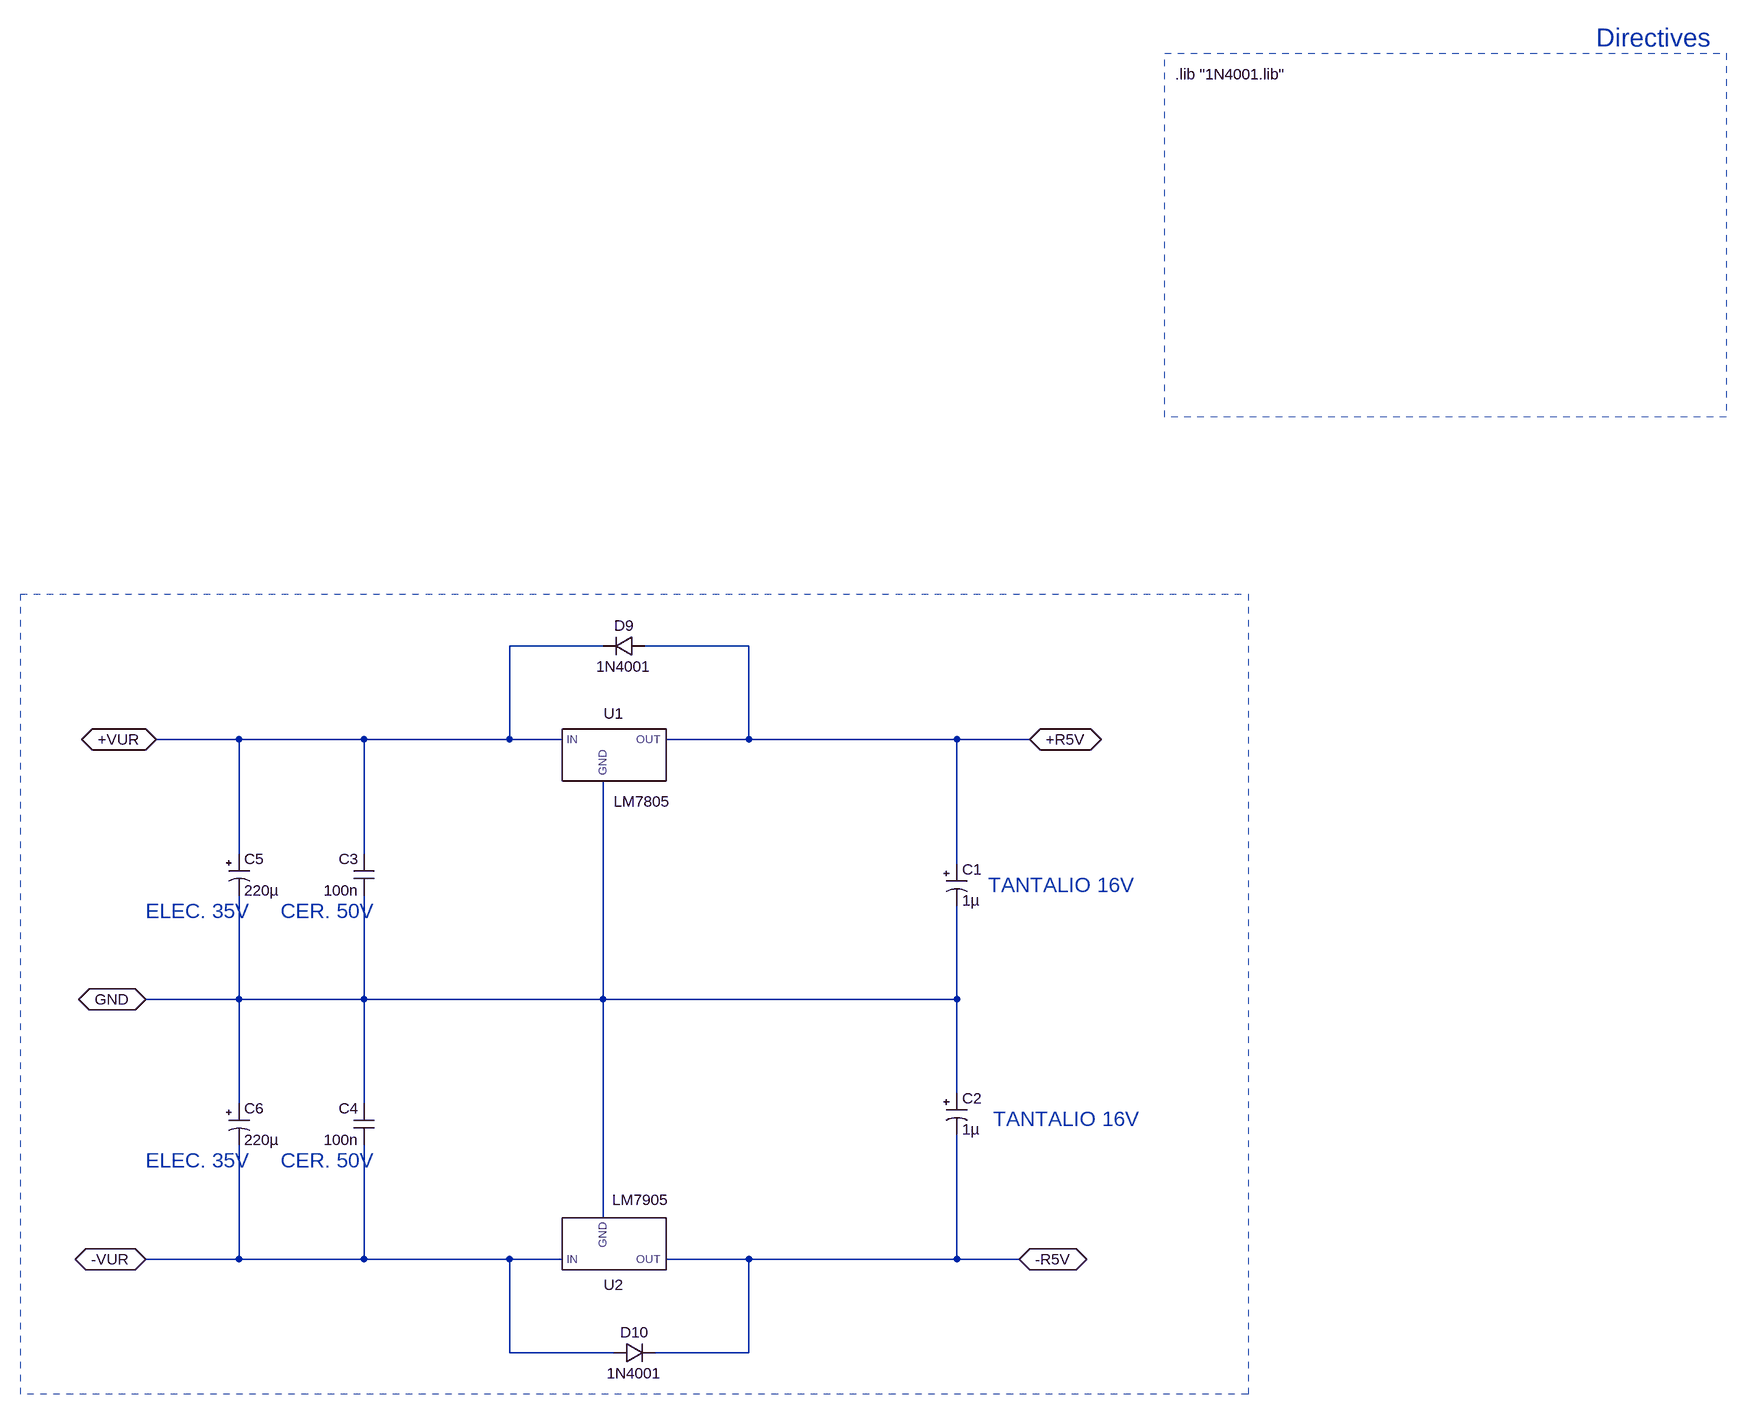
[diagram p0: schematic reg_7805_7905_HB.asc]
reg_7805_7905_HB.asc, the LTspice schematic file:
Version 4
SHEET 1 5728 3316
WIRE 624 -464 480 -464
WIRE 848 -464 688 -464
WIRE 64 -320 -64 -320
WIRE 256 -320 64 -320
WIRE 480 -320 480 -464
WIRE 480 -320 256 -320
WIRE 560 -320 480 -320
WIRE 848 -320 848 -464
WIRE 848 -320 720 -320
WIRE 1168 -320 848 -320
WIRE 1280 -320 1168 -320
WIRE 64 -144 64 -320
WIRE 256 -144 256 -320
WIRE 1168 -128 1168 -320
WIRE 64 80 64 -80
WIRE 64 80 -80 80
WIRE 256 80 256 -80
WIRE 256 80 64 80
WIRE 624 80 624 -256
WIRE 624 80 256 80
WIRE 1168 80 1168 -64
WIRE 1168 80 624 80
WIRE 1168 224 1168 80
WIRE 64 240 64 80
WIRE 256 240 256 80
WIRE 624 416 624 80
WIRE 64 480 64 304
WIRE 64 480 -80 480
WIRE 256 480 256 304
WIRE 256 480 64 480
WIRE 480 480 256 480
WIRE 560 480 480 480
WIRE 848 480 720 480
WIRE 1168 480 1168 288
WIRE 1168 480 848 480
WIRE 1264 480 1168 480
WIRE 480 624 480 480
WIRE 640 624 480 624
WIRE 848 624 848 480
WIRE 848 624 704 624
FLAG -64 -320 +VUR
IOPIN -64 -320 BiDir
FLAG -80 480 -VUR
IOPIN -80 480 BiDir
FLAG 1280 -320 +R5V
IOPIN 1280 -320 BiDir
FLAG 1264 480 -R5V
IOPIN 1264 480 BiDir
FLAG -80 80 GND
IOPIN -80 80 BiDir
SYMBOL polcap 1152 -128 R0
SYMATTR InstName C1
SYMATTR Value 1µ
SYMBOL polcap 48 -144 R0
SYMATTR InstName C5
SYMATTR Value 220µ
SYMBOL polcap 1152 224 R0
SYMATTR InstName C2
SYMATTR Value 1µ
SYMBOL cap 272 -144 M0
SYMATTR InstName C3
SYMATTR Value 100n
SYMBOL polcap 48 240 R0
SYMATTR InstName C6
SYMATTR Value 220µ
SYMBOL cap 272 304 R180
WINDOW 0 24 56 Left 2
WINDOW 3 24 8 Left 2
SYMATTR InstName C4
SYMATTR Value 100n
SYMBOL diode 688 -448 M270
WINDOW 0 32 32 VTop 2
WINDOW 3 0 32 VBottom 2
SYMATTR InstName D9
SYMATTR Value 1N4001
SYMBOL diode 640 640 R270
WINDOW 0 32 32 VTop 2
WINDOW 3 0 32 VBottom 2
SYMATTR InstName D10
SYMATTR Value 1N4001
SYMBOL 7805 640 -304 R0
WINDOW 3 44 64 Top 2
SYMATTR InstName U1
SYMBOL 7905 640 464 M180
WINDOW 3 42 60 Top 2
SYMATTR InstName U2
TEXT 1504 -1344 Left 2 !.lib "1N4001.lib"
TEXT 2152 -1400 Left 4 ;Directives
TEXT 128 -56 Left 3 ;CER. 50V
TEXT 128 328 Left 3 ;CER. 50V
TEXT -80 328 Left 3 ;ELEC. 35V
TEXT -80 -56 Left 3 ;ELEC. 35V
TEXT 1216 -96 Left 3 ;TANTALIO 16V
TEXT 1224 264 Left 3 ;TANTALIO 16V
RECTANGLE Normal 2352 -816 1488 -1376 3
RECTANGLE Normal 1616 688 -272 -544 2

The netlist it stands for:
* reg_7805_7905_HB.asc
C1 +R5V GND 1µ
C5 +VUR GND 220µ
C2 GND -R5V 1µ
C3 +VUR GND 100n
C6 GND -VUR 220µ
C4 -VUR GND 100n
D9 +R5V +VUR 1N4001
D10 -VUR -R5V 1N4001
XU1 +VUR GND +R5V LM7805  ; pins IN GND OUT
XU2 -VUR GND -R5V LM7905  ; pins IN GND OUT
.model D D
.lib standard.dio
.lib "1N4001.lib"
* Directives
* CER. 50V
* CER. 50V
* ELEC. 35V
* ELEC. 35V
* TANTALIO 16V
* TANTALIO 16V
.lib LM7805.lib
.lib LM7905.lib
.backanno
.end